# Altium schematic sheet PIC32MK.SchDoc
size B; DocumentNumber: 3; SheetNumber: 3; SheetTotal: 4
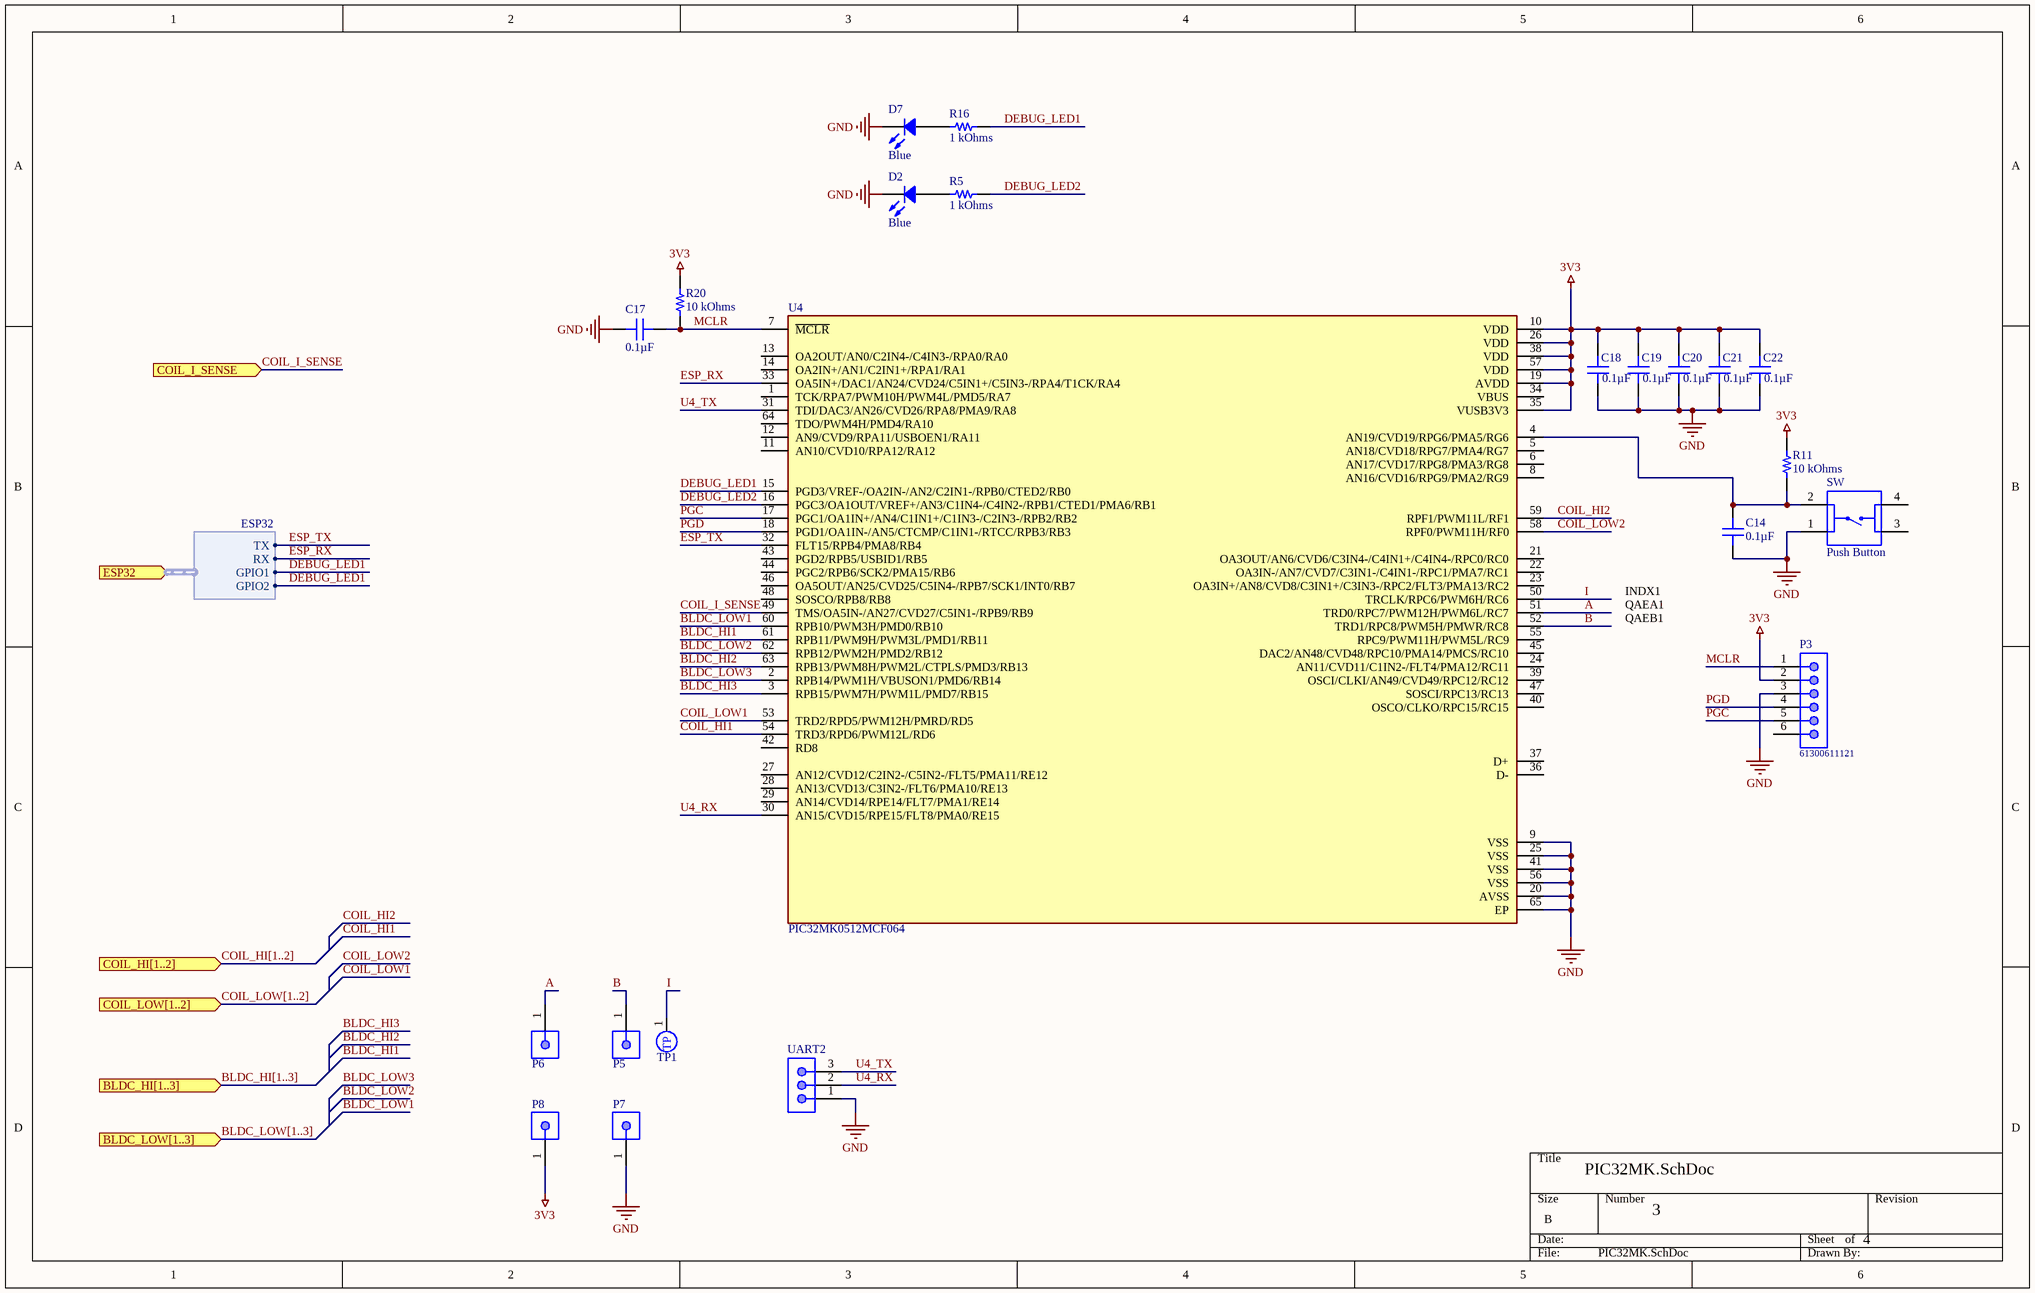
[diagram p0: PIC32MK.SchDoc]

## Parts
C14  0.1µF  [CAP 0603_1608]
C17  0.1µF  [CAP 0603_1608]
C18  0.1µF  [CAP 0603_1608]
C19  0.1µF  [CAP 0603_1608]
C20  0.1µF  [CAP 0603_1608]
C21  0.1µF  [CAP 0603_1608]
C22  0.1µF  [CAP 0603_1608]
D2  Blue  [LED 0603_1608 GREEN]
D7  Blue  [LED 0603_1608 GREEN]
P3  61300611121  [61300611121]
P5  61300111121  [61300111121]  (value not drawn)
P6  61300111121  [61300111121]  (value not drawn)
P7  61300111121  [61300111121]  (value not drawn)
P8  61300111121  [61300111121]  (value not drawn)
R5  1 kOhms  [RES 0603_1608]
R11  10 kOhms  [RES 0603_1608]
R16  1 kOhms  [RES 0603_1608]
R20  10 kOhms  [RES 0603_1608]
SW  Push Button  [PushButton]
TP1  TP  [TP]  (value not drawn)
U4  PIC32MK0512MCF064  [QFN50P900X900X100-65N]
UART2  3 pin 2mm JST Male  [3pin - 2mm header]  (value not drawn)

## Ports
BLDC_HI[1..3] (in), BLDC_LOW[1..3] (in), COIL_HI[1..2] (in), COIL_I_SENSE (in), COIL_LOW[1..2] (in), ESP32 (in, harness ESP32)

## Harnesses
ESP32: TX, RX, GPIO1, GPIO2

## Nets
3V3: C18.1 C19.1 C20.1 C21.1 C22.1 P3.2 P8.1 R11.2 R20.2 U4.10(VDD) U4.19(AVDD) U4.26(VDD) U4.35(VUSB3V3) U4.38(VDD) U4.57(VDD)
GND: C14.2 C17.2 C18.2 C19.2 C20.2 C21.2 C22.2 D2.2 D7.2 P3.3 P7.1 SW.1 U4.9(VSS) U4.20(AVSS) U4.25(VSS) U4.41(VSS) U4.56(VSS) U4.65(EP) UART2.1
A: P6.1 U4.51(TRD0/RPC7/PWM12H/PWM6L/RC7)
B: P5.1 U4.52(TRD1/RPC8/PWM5H/PMWR/RC8)
BLDC_HI1: U4.61(RPB11/PWM9H/PWM3L/PMD1/RB11)
BLDC_HI2: U4.63(RPB13/PWM8H/PWM2L/CTPLS/PMD3/RB13)
BLDC_HI3: U4.3(RPB15/PWM7H/PWM1L/PMD7/RB15)
BLDC_LOW1: U4.60(RPB10/PWM3H/PMD0/RB10)
BLDC_LOW2: U4.62(RPB12/PWM2H/PMD2/RB12)
BLDC_LOW3: U4.2(RPB14/PWM1H/VBUSON1/PMD6/RB14)
COIL_HI1: U4.54(TRD3/RPD6/PWM12L/RD6)
COIL_HI2: U4.59(RPF1/PWM11L/RF1)
COIL_I_SENSE: U4.49(TMS/OA5IN-/AN27/CVD27/C5IN1-/RPB9/RB9) ; port COIL_I_SENSE
COIL_LOW1: U4.53(TRD2/RPD5/PWM12H/PMRD/RD5)
COIL_LOW2: U4.58(RPF0/PWM11H/RF0)
DEBUG_LED1: R16.1 U4.15(PGD3/VREF-/OA2IN-/AN2/C2IN1-/RPB0/CTED2/RB0) ; port ESP32.GPIO1, port ESP32.GPIO2
DEBUG_LED2: R5.1 U4.16(PGC3/OA1OUT/VREF+/AN3/C1IN4-/C4IN2-/RPB1/CTED1/PMA6/RB1)
ESP_RX: U4.33(OA5IN+/DAC1/AN24/CVD24/C5IN1+/C5IN3-/RPA4/T1CK/RA4) ; port ESP32.RX
ESP_TX: U4.32(FLT15/RPB4/PMA8/RB4) ; port ESP32.TX
I: TP1.1(TP) U4.50(TRCLK/RPC6/PWM6H/RC6)
MCLR: C17.1 P3.1 R20.1 U4.7(~{MCLR})
PGC: P3.5 U4.17(PGC1/OA1IN+/AN4/C1IN1+/C1IN3-/C2IN3-/RPB2/RB2)
PGD: P3.4 U4.18(PGD1/OA1IN-/AN5/CTCMP/C1IN1-/RTCC/RPB3/RB3)
U4_RX: U4.30(AN15/CVD15/RPE15/FLT8/PMA0/RE15) UART2.2
U4_TX: U4.31(TDI/DAC3/AN26/CVD26/RPA8/PMA9/RA8) UART2.3
NetC14_1: C14.1 R11.1 SW.2 U4.4(AN19/CVD19/RPG6/PMA5/RG6)
NetD2_1: D2.1 R5.2
NetD7_1: D7.1 R16.2

Not connected (* = marked no-connect by the designer): P3 6; SW 3 4; U4 1(TCK/RPA7/PWM10H/PWM4L/PMD5/RA7) 5(AN18/CVD18/RPG7/PMA4/RG7) 6(AN17/CVD17/RPG8/PMA3/RG8) 8(AN16/CVD16/RPG9/PMA2/RG9) 11(AN10/CVD10/RPA12/RA12) 12(AN9/CVD9/RPA11/USBOEN1/RA11) 13(OA2OUT/AN0/C2IN4-/C4IN3-/RPA0/RA0) 14(OA2IN+/AN1/C2IN1+/RPA1/RA1) 21(OA3OUT/AN6/CVD6/C3IN4-/C4IN1+/C4IN4-/RPC0/RC0) 22(OA3IN-/AN7/CVD7/C3IN1-/C4IN1-/RPC1/PMA7/RC1) 23(OA3IN+/AN8/CVD8/C3IN1+/C3IN3-/RPC2/FLT3/PMA13/RC2) 24(AN11/CVD11/C1IN2-/FLT4/PMA12/RC11) 27(AN12/CVD12/C2IN2-/C5IN2-/FLT5/PMA11/RE12) 28(AN13/CVD13/C3IN2-/FLT6/PMA10/RE13) 29(AN14/CVD14/RPE14/FLT7/PMA1/RE14) 34(VBUS) 36(D-) 37(D+) 39(OSCI/CLKI/AN49/CVD49/RPC12/RC12) 40(OSCO/CLKO/RPC15/RC15) 42(RD8) 43(PGD2/RPB5/USBID1/RB5) 44(PGC2/RPB6/SCK2/PMA15/RB6) 45(DAC2/AN48/CVD48/RPC10/PMA14/PMCS/RC10) 46(OA5OUT/AN25/CVD25/C5IN4-/RPB7/SCK1/INT0/RB7) 47(SOSCI/RPC13/RC13) 48(SOSCO/RPB8/RB8) 55(RPC9/PWM11H/PWM5L/RC9) 64(TDO/PWM4H/PMD4/RA10)

## Buses and harness runs
bus BLDC_HI[1..3] = port BLDC_HI[1..3]
bus BLDC_LOW[1..3] = port BLDC_LOW[1..3]
bus COIL_HI[1..2] = port COIL_HI[1..2]
bus COIL_LOW[1..2] = port COIL_LOW[1..2]

## Notes on the sheet
- QAEB1
- QAEA1
- INDX1

## Library data of the parts
C14 C17-C22 = GCG188R92A104KA03D: CAP CER 0.1UF 100V 0603 EPOXY; Manufacturer: Murata Electronics; Temperature Coefficient: X8R; Tolerance: ±10%; Part Number: GCG188R92A104KA03D; Value: 0.1µF; Applications: Automotive; Capacitance: 0.1µF; ComponentLink1Description: Datasheet; ComponentLink1URL: https://search.murata.co.jp/Ceramy/image/img/A01X/G101/ENG/GCG188R92A104KA03-01.pdf; ComponentLink2Description: DigiKey Link; ComponentLink2URL: http://digikey.com/product-detail/en/murata-electronics/GCG188R92A104KA03D/490-18197-1-ND/9867926; Device Package: 0603 (1608 Metric); Features: Epoxy Mountable; LastUpdated: 21-Jan-20 12:01:59 AM; Lifecycle Status: Active; Minimum Order: 1; Mounting Type: Surface Mount, MLCC, Epoxy; Operating Temperature: -55°C ~ 150°C; Package / Case: 0603 (1608 Metric); Packaging: TapeAndReel; PartId: 9025; Part Status: Active; Price: 0.07; Ratings: AEC-Q200; Series: GCG; Size / Dimension: 0.063" L x 0.031" W (1.60mm x 0.80mm); Supplier 1: DigiKey; Supplier Part Number 1: 490-18197-1-ND; Thickness (Max): 0.035" (0.90mm); Voltage - Rated: 100V
D2 D7 = XZCDGK53W-8VF: Blue LED; Manufacturer: SunLED; Color: Green; Configuration: Independent; Current - Test: 2mA; Lens Color: Colorless; Lens Size: 0.35mm Dia; Lens Style: Round with Domed Top; Lens Transparency: Clear; Millicandela Rating: 417mcd; Value: Green; Viewing Angle: 60°; Voltage - Forward (Vf) (Typ): 2.65V; Wavelength - Dominant: 525nm; Wavelength - Peak: 515nm; Part Number: XZCDGK53W-8VF; ComponentLink1Description: Datasheet; ComponentLink1URL: https://www.sunledusa.com/products/spec/XZCDGK53W-8VF.pdf; ComponentLink2Description: DigiKey Link; ComponentLink2URL: http://digikey.com/product-detail/en/sunled/XZCDGK53W-8VF/1497-XZCDGK53W-8VFCT-ND/10449792; Device Package: 0603 (1608 Metric); Height (Max): 1.10mm; LastUpdated: 21-Jan-20 3:12:09 AM; Lifecycle Status: Active; Minimum Order: 1; Mounting Type: Surface Mount; Package / Case: 0603 (1608 Metric); Packaging: Unknown; PartId: 938; Part Status: Active; Price: 0.18; Series: Ultra Low Current; Size / Dimension: 1.60mm L x 0.80mm W; Supplier 1: DigiKey; Supplier Part Number 1: 1497-XZCDGK53W-8VFCT-ND; Supplier Device Package: 2-SMD
P3 = 61300611121: WR-PHD Pin Header, THT, pitch 2.54mm, Single Row, Vertical, 6p; Manufacturer: Wurth Elektronik; Pin Number: 6; Rated Current: 3A; Working Voltage: 250VAC; Withstanding Voltage: 500VAC; Contact Resistance: 20mOhm; ComponentLink1Description: Manufacturer; ComponentLink1URL: http://www.we-online.de; ComponentLink2Description: Datasheet; ComponentLink2URL: https://www.we-online.com/catalog/datasheet/61300611121.pdf; Manufacturer Part Number: 61300611121; Published Date: May 2020; Pitch: 2.54mm; Operating Temperature: -40 to +105degC; Mounting Technology: THT; Packaging: Bag; Gender: Pin Header; Row Number: Single; Orientation: Vertical
P5-P8 = 61300111121: WR-PHD Pin Header, THT, pitch 2.54mm, Single Row, Vertical, 1p; Manufacturer: Wurth Elektronik; Pin Number: 1; Rated Current: 3A; Working Voltage: 250VAC; Withstanding Voltage: 500VAC; Contact Resistance: 20mOhm; ComponentLink1Description: Manufacturer; ComponentLink1URL: http://www.we-online.de; ComponentLink2Description: Datasheet; ComponentLink2URL: https://www.we-online.com/catalog/datasheet/61300111121.pdf; Manufacturer Part Number: 61300111121; Published Date: May 2020; Pitch: 2.54mm; Operating Temperature: -40 to +105degC; Mounting Technology: THT; Packaging: Bag; Gender: Pin Header; Row Number: Single; Orientation: Vertical
R5 R16 = RNCF0603DTE1K00: RES 1K OHM 0.5% 1/10W 0603; Manufacturer: Stackpole Electronics Inc; Power (Watts): 0.1W, 1/10W; Temperature Coefficient: ±25ppm/°C; Part Number: RNCF0603DTE1K00; Value: 1 kOhms; ComponentLink1Description: Datasheet; ComponentLink1URL: https://www.seielect.com/catalog/sei-rncf.pdf; ComponentLink2Description: DigiKey Link; ComponentLink2URL: http://digikey.com/product-detail/en/stackpole-electronics-inc/RNCF0603DTE1K00/RNCF0603DTE1K00CT-ND/9915086; Composition: Thin Film; Device Package: 0603 (1608 Metric); Features: Automotive AEC-Q200; Height - Seated (Max): 0.022" (0.55mm); LastUpdated: 21-Jan-20 12:14:28 AM; Lifecycle Status: Active; Minimum Order: 1; Number of Terminations: 2; Operating Temperature: -55°C ~ 155°C; Package / Case: 0603 (1608 Metric); Packaging: TapeAndReel; PartId: 26300; Part Status: Active; Price: 0.05; Ratings: AEC-Q200; Resistance: 1 kOhms; Series: RNCF; Size / Dimension: 0.061" L x 0.031" W (1.55mm x 0.80mm); Supplier 1: DigiKey; Supplier Part Number 1: RNCF0603DTE1K00CT-ND; Supplier Device Package: 0603; Tolerance: ±0.5%
R11 R20 = RNCS0603BKE10K0: RES 10K OHM 0.1% 1/16W 0603; Manufacturer: Stackpole Electronics Inc; Power (Watts): 0.063W, 1/16W; Temperature Coefficient: ±25ppm/°C; Part Number: RNCS0603BKE10K0; Value: 10 kOhms; ComponentLink1Description: Datasheet; ComponentLink1URL: https://www.seielect.com/catalog/sei-rncs_rnch.pdf; ComponentLink2Description: DigiKey Link; ComponentLink2URL: http://digikey.com/product-detail/en/stackpole-electronics-inc/RNCS0603BKE10K0/RNCS0603BKE10K0CT-ND/1800113; Composition: Thin Film; Device Package: 0603 (1608 Metric); Features: Anti-Corrosive, Automotive AEC-Q200, Moisture Resistant; Height - Seated (Max): 0.022" (0.55mm); LastUpdated: 21-Jan-20 12:25:01 AM; Lifecycle Status: Active; Minimum Order: 1; Number of Terminations: 2; Operating Temperature: -55°C ~ 155°C; Package / Case: 0603 (1608 Metric); Packaging: TapeAndReel; PartId: 4838; Part Status: Active; Price: 0.08; Ratings: AEC-Q200; Resistance: 10 kOhms; Series: RNCS; Size / Dimension: 0.061" L x 0.031" W (1.55mm x 0.80mm); Supplier 1: DigiKey; Supplier Part Number 1: RNCS0603BKE10K0CT-ND; Supplier Device Package: 0603; Tolerance: ±0.1%
SW = Push Button: 50 mA SPST Round Actuator 160 Gram Force Tactile Pushbutton Switch; MP: 1825910-2; Contact_Current_Rating: 50 mA; MF: TE Connectivity; Configuration_Pole-Throw: Single Pole - Single Throw; Availability: Unavailable; Value: *; Package: None; SnapEDA_Link: https://www.snapeda.com/parts/1825910-2/TE%20Connectivity%20ALCOSWITCH%20Switches/view-part/278983/?ref=snap; TE_purchase_URL: https://www.te.com/usa-en/product-1825910-2.html?te_bu=Cor&te_type=disp&te_campaign=seda_glo_cor-seda-global-disp-prtnr-fy19-seda-model-bom-cta_sma-317_1&elqCampaignId=32493; EU_RoHS_Compliance: Compliant; Price: None
TP1 = TP: Test point
U4 = PIC32MK0512MCF064: PIC32MK Microcontroller IC 32-Bit 120MHz 1MB _1M x 8_ FLASH 64-TQFP _10x10_; MP: PIC32MK1024MCF064-I/PT; MF: Microchip; Digi-Key_Purchase_URL: https://www.digikey.kr/product-detail/en/microchip-technology/PIC32MK1024MCF064-I-PT/PIC32MK1024MCF064-I-PT-ND/7164902?utm_source=snapeda&utm_medium=aggregator&utm_campaign=symbol; Package: TQFP-64 Microchip; Digi-Key_Part_Number: PIC32MK1024MCF064-I/PT-ND; Value: *; SnapEDA_Link: https://www.snapeda.com/parts/PIC32MK1024MCF064-I/PT/Microchip/view-part/876704/?ref=snap